# Altium schematic sheet FC_Conn.SchDoc
size A3; SheetNumber: 6; SheetTotal: 10
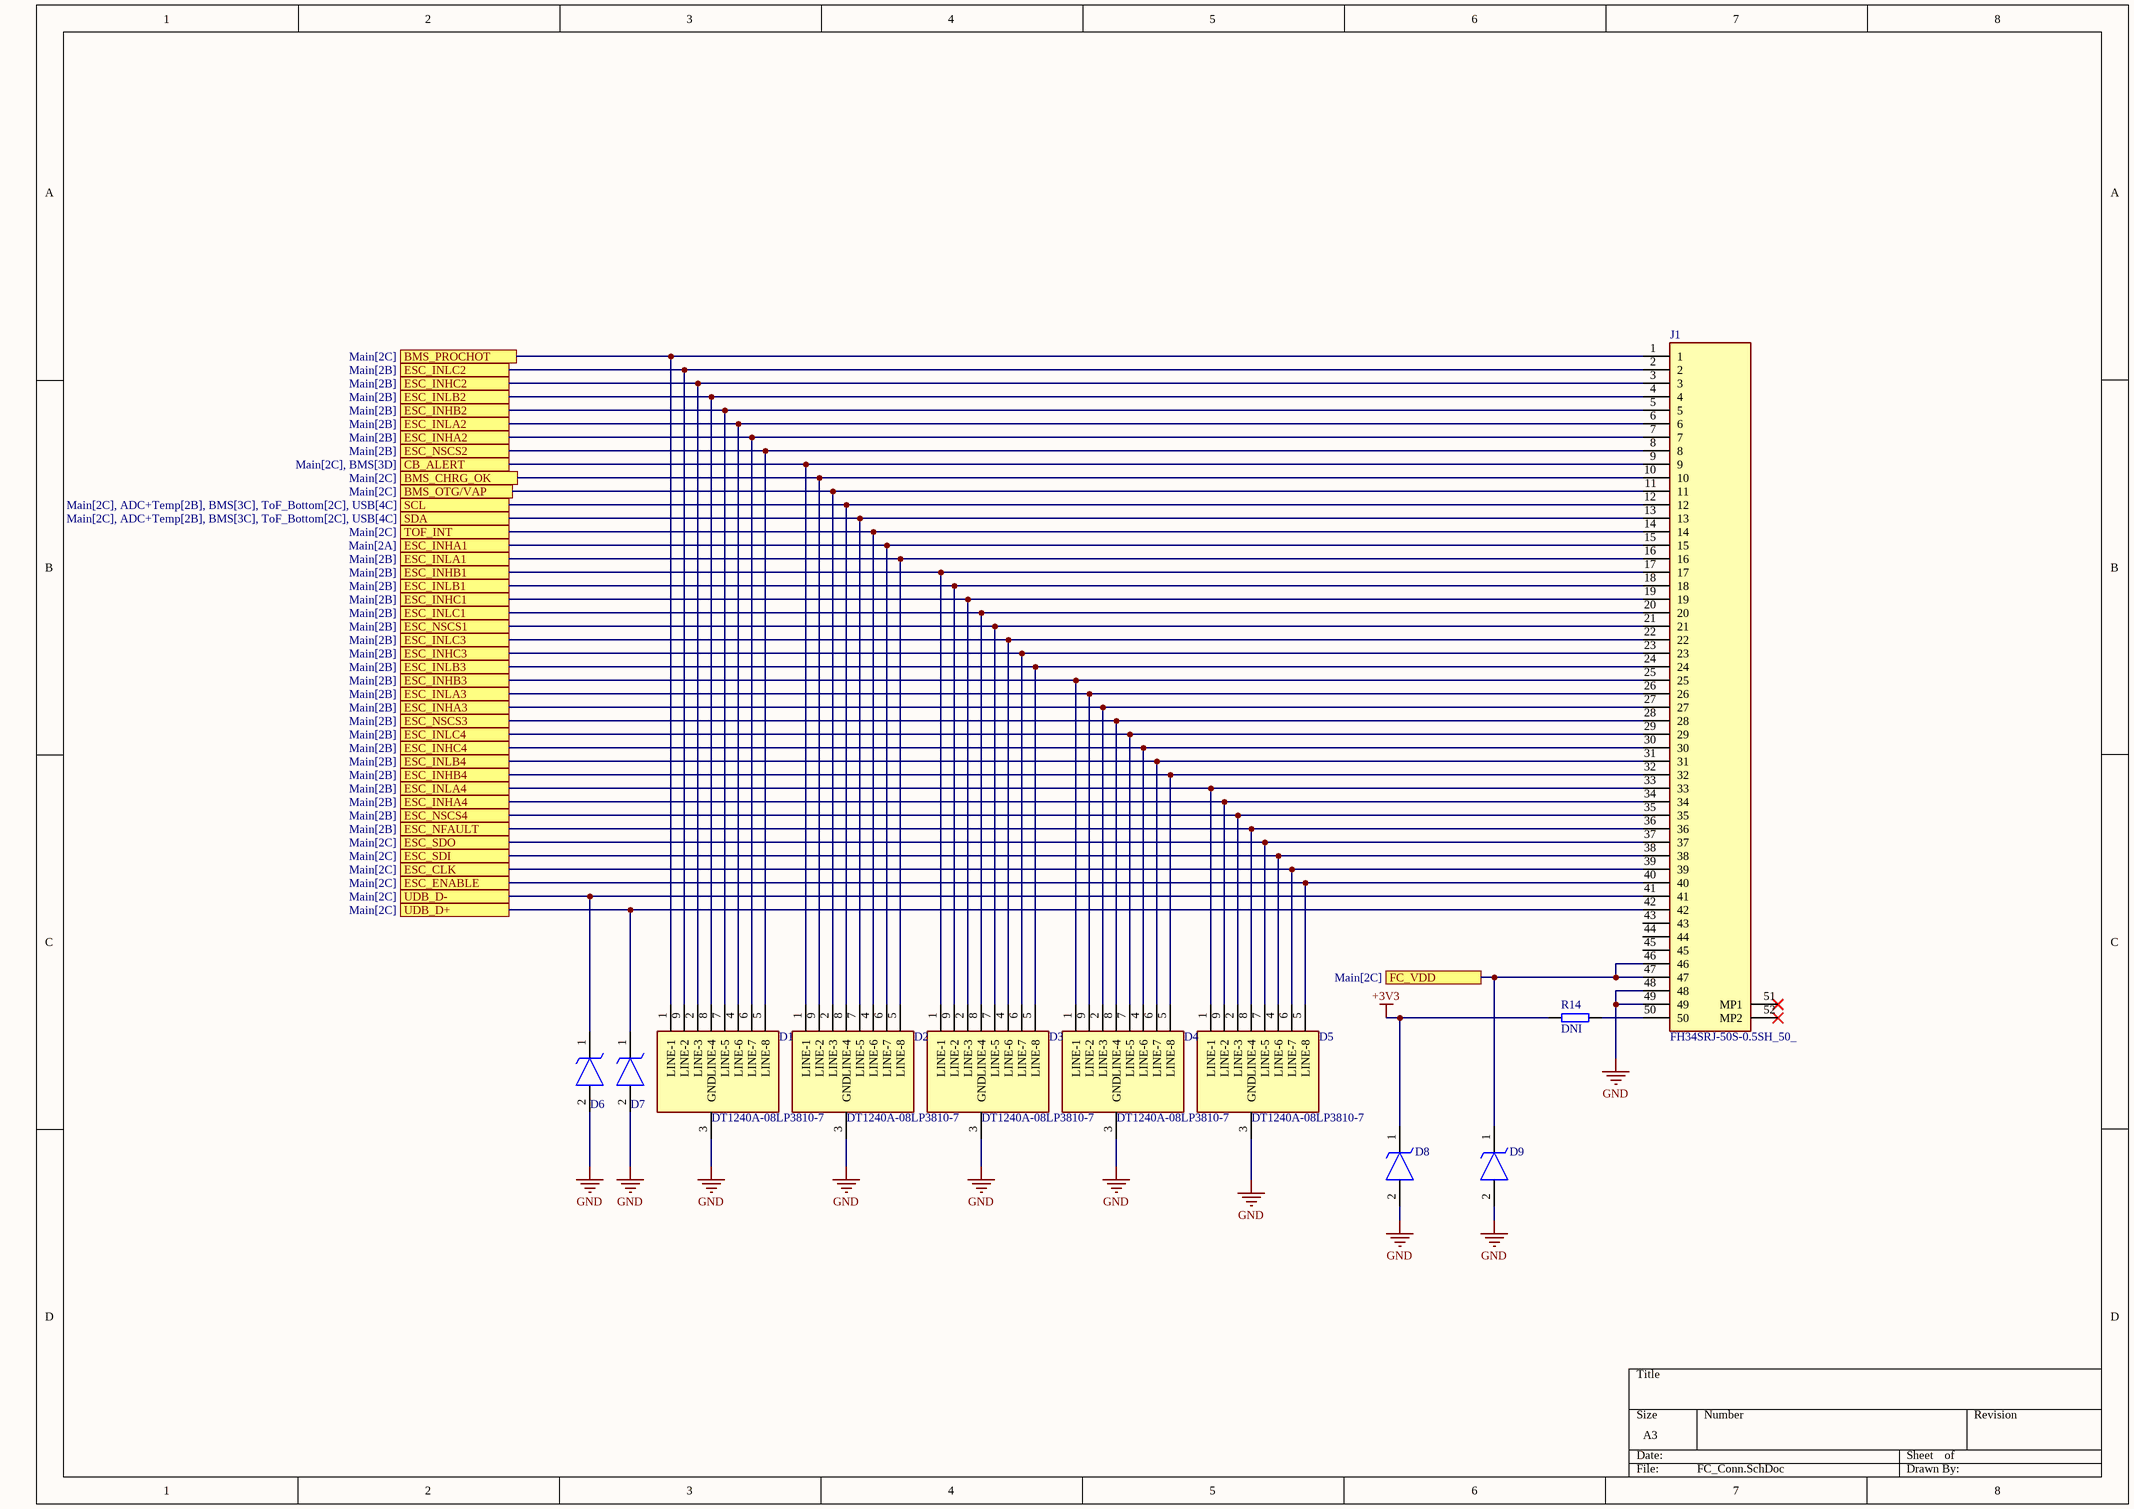
[diagram p0: FC_Conn.SchDoc]

## Parts
D1  DT1240A-08LP3810-7  [DT1240A08LP38107]
D2  DT1240A-08LP3810-7  [DT1240A08LP38107]
D3  DT1240A-08LP3810-7  [DT1240A08LP38107]
D4  DT1240A-08LP3810-7  [DT1240A08LP38107]
D5  DT1240A-08LP3810-7  [DT1240A08LP38107]
D6  D1213A-01LP4-7B  [D1213A01LP47B]  (value not drawn)
D7  D1213A-01LP4-7B  [D1213A01LP47B]  (value not drawn)
D8  DF2S24FS,L3M  [SODFL1006X45N]  (value not drawn)
D9  DF2S24FS,L3M  [SODFL1006X45N]  (value not drawn)
J1  FH34SRJ-50S-0.5SH_50_  [FH34SRJ50S05SH50]
R14  value DNI  [RES0402]  (hidden comment: Res0402)

## Ports
BMS_CHRG_OK (see Main[2C]), BMS_OTG/VAP (see Main[2C]), BMS_PROCHOT (see Main[2C]), CB_ALERT (see Main[2C], BMS[3D]), ESC_CLK (see Main[2C]), ESC_ENABLE (see Main[2C]), ESC_INHA1 (see Main[2A]), ESC_INHA2 (see Main[2B]), ESC_INHA3 (see Main[2B]), ESC_INHA4 (see Main[2B]), ESC_INHB1 (see Main[2B]), ESC_INHB2 (see Main[2B]), ESC_INHB3 (see Main[2B]), ESC_INHB4 (see Main[2B]), ESC_INHC1 (see Main[2B]), ESC_INHC2 (see Main[2B]), ESC_INHC3 (see Main[2B]), ESC_INHC4 (see Main[2B]), ESC_INLA1 (see Main[2B]), ESC_INLA2 (see Main[2B]), ESC_INLA3 (see Main[2B]), ESC_INLA4 (see Main[2B]), ESC_INLB1 (see Main[2B]), ESC_INLB2 (see Main[2B]), ESC_INLB3 (see Main[2B]), ESC_INLB4 (see Main[2B]), ESC_INLC1 (see Main[2B]), ESC_INLC2 (see Main[2B]), ESC_INLC3 (see Main[2B]), ESC_INLC4 (see Main[2B]), ESC_NFAULT (see Main[2B]), ESC_NSCS1 (see Main[2B]), ESC_NSCS2 (see Main[2B]), ESC_NSCS3 (see Main[2B]), ESC_NSCS4 (see Main[2B]), ESC_SDI (see Main[2C]), ESC_SDO (see Main[2C]), FC_VDD (see Main[2C]), SCL (see Main[2C], ADC+Temp[2B], BMS[3C], ToF_Bottom[2C], USB[4C]), SDA (see Main[2C], ADC+Temp[2B], BMS[3C], ToF_Bottom[2C], USB[4C]), TOF_INT (see Main[2C]), UDB_D+ (see Main[2C]), UDB_D- (see Main[2C])

## Nets
+3V3: D8.1(K) R14.2
GND: D1.3(GND) D2.3(GND) D3.3(GND) D4.3(GND) D5.3(GND) D6.2(A) D7.2(A) D8.2(A) D9.2(A) J1.48 J1.49
BMS_CHRG_OK: D2.9(LINE-2) J1.10 ; port BMS_CHRG_OK
BMS_OTG/VAP: D2.2(LINE-3) J1.11 ; port BMS_OTG/VAP
BMS_PROCHOT: D1.1(LINE-1) J1.1 ; port BMS_PROCHOT
CB_ALERT: D2.1(LINE-1) J1.9 ; port CB_ALERT
ESC_CLK: D5.6(LINE-7) J1.39 ; port ESC_CLK
ESC_ENABLE: D5.5(LINE-8) J1.40 ; port ESC_ENABLE
ESC_INHA1: D2.6(LINE-7) J1.15 ; port ESC_INHA1
ESC_INHA2: D1.6(LINE-7) J1.7 ; port ESC_INHA2
ESC_INHA3: D4.2(LINE-3) J1.27 ; port ESC_INHA3
ESC_INHA4: D5.9(LINE-2) J1.34 ; port ESC_INHA4
ESC_INHB1: D3.1(LINE-1) J1.17 ; port ESC_INHB1
ESC_INHB2: D1.7(LINE-5) J1.5 ; port ESC_INHB2
ESC_INHB3: D4.1(LINE-1) J1.25 ; port ESC_INHB3
ESC_INHB4: D4.5(LINE-8) J1.32 ; port ESC_INHB4
ESC_INHC1: D3.2(LINE-3) J1.19 ; port ESC_INHC1
ESC_INHC2: D1.2(LINE-3) J1.3 ; port ESC_INHC2
ESC_INHC3: D3.6(LINE-7) J1.23 ; port ESC_INHC3
ESC_INHC4: D4.4(LINE-6) J1.30 ; port ESC_INHC4
ESC_INLA1: D2.5(LINE-8) J1.16 ; port ESC_INLA1
ESC_INLA2: D1.4(LINE-6) J1.6 ; port ESC_INLA2
ESC_INLA3: D4.9(LINE-2) J1.26 ; port ESC_INLA3
ESC_INLA4: D5.1(LINE-1) J1.33 ; port ESC_INLA4
ESC_INLB1: D3.9(LINE-2) J1.18 ; port ESC_INLB1
ESC_INLB2: D1.8(LINE-4) J1.4 ; port ESC_INLB2
ESC_INLB3: D3.5(LINE-8) J1.24 ; port ESC_INLB3
ESC_INLB4: D4.6(LINE-7) J1.31 ; port ESC_INLB4
ESC_INLC1: D3.8(LINE-4) J1.20 ; port ESC_INLC1
ESC_INLC2: D1.9(LINE-2) J1.2 ; port ESC_INLC2
ESC_INLC3: D3.4(LINE-6) J1.22 ; port ESC_INLC3
ESC_INLC4: D4.7(LINE-5) J1.29 ; port ESC_INLC4
ESC_NFAULT: D5.8(LINE-4) J1.36 ; port ESC_NFAULT
ESC_NSCS1: D3.7(LINE-5) J1.21 ; port ESC_NSCS1
ESC_NSCS2: D1.5(LINE-8) J1.8 ; port ESC_NSCS2
ESC_NSCS3: D4.8(LINE-4) J1.28 ; port ESC_NSCS3
ESC_NSCS4: D5.2(LINE-3) J1.35 ; port ESC_NSCS4
ESC_SDI: D5.4(LINE-6) J1.38 ; port ESC_SDI
ESC_SDO: D5.7(LINE-5) J1.37 ; port ESC_SDO
FC_VDD: D9.1(K) J1.46 J1.47 ; port FC_VDD
SCL: D2.8(LINE-4) J1.12 ; port SCL
SDA: D2.7(LINE-5) J1.13 ; port SDA
TOF_INT: D2.4(LINE-6) J1.14 ; port TOF_INT
UDB_D+: D7.1(K) J1.42 ; port UDB_D+
UDB_D-: D6.1(K) J1.41 ; port UDB_D-
NetJ1_50: J1.50 R14.1

Not connected (* = marked no-connect by the designer): J1 43 44 45 51(MP1)* 52(MP2)*

## Notes on the sheet
- Each ESC can output 30mA, PB schould be able to sustain itself

## Library data of the parts
D1-D5 = DT1240A-08LP3810-7: TVS Diode (Uni-directional); Manufacturer_Name: Diodes Incorporated; Datasheet Link: https://www.diodes.com//assets/Datasheets/DT1240A-08LP3810.pdf; Height: 0.55mm; Manufacturer_Part_Number: DT1240A-08LP3810-7; Mouser Part Number: 621-DT1240A08LP38107; Mouser Price/Stock: https://www.mouser.co.uk/ProductDetail/Diodes-Incorporated/DT1240A-08LP3810-7?qs=W0yvOO0ixfFwCalJyqXN4A%3D%3D; Arrow Part Number: DT1240A-08LP3810-7; Arrow Price/Stock: null?region=nac
D6 D7 = D1213A-01LP4-7B: TVS Diode (Uni-directional); Manufacturer_Name: Diodes Incorporated; Datasheet Link: https://www.diodes.com/assets/Datasheets/D1213A-01LP4.pdf; Height: 0.4mm; Manufacturer_Part_Number: D1213A-01LP4-7B; Mouser Part Number: 621-D1213A-01LP4-7B; Mouser Price/Stock: https://www.mouser.co.uk/ProductDetail/Diodes-Incorporated/D1213A-01LP4-7B?qs=gfe7vQ8txpVKfG5NOSOvfA%3D%3D; Arrow Part Number: D1213A-01LP4-7B; Arrow Price/Stock: https://www.arrow.com/en/products/d1213a-01lp4-7b/diodes-incorporated?region=europe
D8 D9 = DF2S24FS,L3M: TVS Diode (Uni-directional); Manufacturer_Name: Toshiba; Datasheet Link: https://www.mouser.com/datasheet/2/408/DF2S24FS_datasheet_en_20140718-708374.pdf; Height: 0.45mm; Manufacturer_Part_Number: DF2S24FS,L3M; Mouser Part Number: 757-DF2S24FSL3M; Mouser Price/Stock: https://www.mouser.co.uk/ProductDetail/Toshiba/DF2S24FSL3M?qs=lhkzy8lC%252BSvG2umxl0FuEw%3D%3D; Arrow Part Number: DF2S24FS,L3M; Arrow Price/Stock: https://www.arrow.com/en/products/df2s24fsl3m/toshiba?region=nac
J1 = FH34SRJ-50S-0.5SH_50_: Connector; Manufacturer_Name: Hirose; Manufacturer_Part_Number: FH34SRJ-50S-0.5SH(50); Datasheet Link: https://www.hirose.com/en/product/document?clcode=CL0580-1266-2-50&productname=FH34SRJ-50S-0.5SH(50)&series=FH34SRJ&documenttype=2DDrawing&lang=en&documentid=0001483059; Height: 1.75mm; Mouser Part Number: 798-FH34SRJ50S05SH50; Mouser Price/Stock: https://www.mouser.co.uk/ProductDetail/Hirose-Connector/FH34SRJ-50S-0.5SH50?qs=vcbW%252B4%252BSTIrLLD%2F8H%2F%252B%2Fhg%3D%3D; System: Connector